# EAGLE design Blinker Board (EAGLE 6.4)
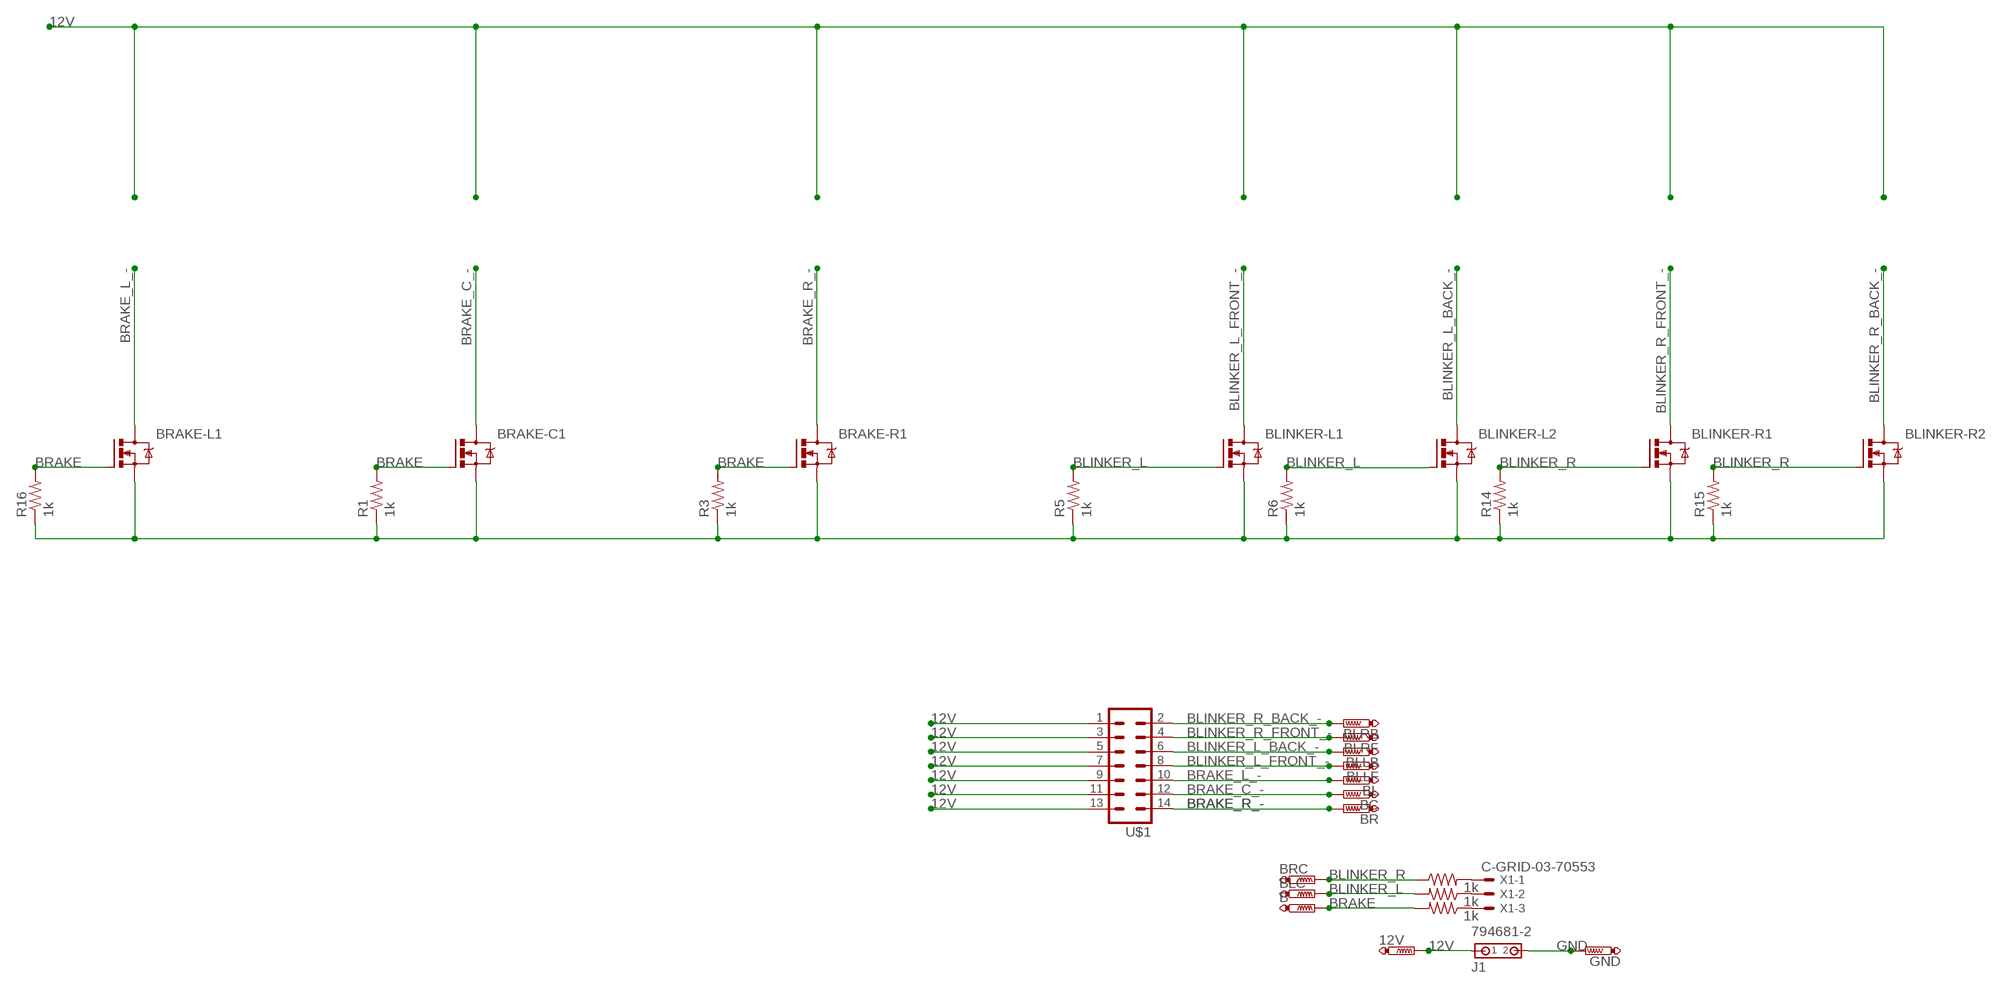
[diagram p0: schematic, sheet 1]

## Parts
12V  TESTPAD-20MIL  [20MIL]
B  TESTPAD-20MIL  [20MIL]
BC  TESTPAD-20MIL  [20MIL]
BL  TESTPAD-20MIL  [20MIL]
BLC  TESTPAD-20MIL  [20MIL]
BLINKER-L1  PMV56XN215  N-CHANNEL_MOSFETPMV56XN,215  [SOT23]
BLINKER-L2  PMV56XN215  N-CHANNEL_MOSFETPMV56XN,215  [SOT23]
BLINKER-R1  PMV56XN215  N-CHANNEL_MOSFETPMV56XN,215  [SOT23]
BLINKER-R2  PMV56XN215  N-CHANNEL_MOSFETPMV56XN,215  [SOT23]
BLLB  TESTPAD-20MIL  [20MIL]
BLLF  TESTPAD-20MIL  [20MIL]
BLRB  TESTPAD-20MIL  [20MIL]
BLRF  TESTPAD-20MIL  [20MIL]
BR  TESTPAD-20MIL  [20MIL]
BRAKE-C1  N-CHANNEL_MOSFETPMV56XN,215  [SOT23]
BRAKE-L1  PMV56XN215  N-CHANNEL_MOSFETPMV56XN,215  [SOT23]
BRAKE-R1  PMV56XN215  N-CHANNEL_MOSFETPMV56XN,215  [SOT23]
BRC  TESTPAD-20MIL  [20MIL]
GND  TESTPAD-20MIL  [20MIL]
J1  794681-2  [794681-2]
R1  1k  RESISTORSMD1206  [R1206]
R3  1k  RESISTORSMD1206  [R1206]
R5  1k  RESISTORSMD1206  [R1206]
R6  1k  RESISTORSMD1206  [R1206]
R7  1k  RESISTORSMD1206  [R1206]
R9  1k  RESISTORSMD1206  [R1206]
R10  1k  RESISTORSMD1206  [R1206]
R14  1k  RESISTORSMD1206  [R1206]
R15  1k  RESISTORSMD1206  [R1206]
R16  1k  RESISTORSMD1206  [R1206]
U$1  AMP_LATCH_14  [MA14-2]
X1  C-GRID-03-70553  [70553-03]

## Nets
12V: 12V.P$1(TP) J1.1 U$1.1 U$1.3 U$1.5 U$1.7 U$1.9 U$1.11 U$1.13
BLINKER_L: BLC.P$1(TP) BLINKER-L1.1(G) BLINKER-L2.1(G) R5.2 R6.2 R10.2
BLINKER_L_BACK_-: BLINKER-L2.3(D) BLLB.P$1(TP) U$1.6
BLINKER_L_FRONT_-: BLINKER-L1.3(D) BLLF.P$1(TP) U$1.8
BLINKER_R: BLINKER-R1.1(G) BLINKER-R2.1(G) BRC.P$1(TP) R7.1 R14.2 R15.2
BLINKER_R_BACK_-: BLINKER-R2.3(D) BLRB.P$1(TP) U$1.2
BLINKER_R_FRONT_-: BLINKER-R1.3(D) BLRF.P$1(TP) U$1.4
BRAKE: B.P$1(TP) BRAKE-C1.1(G) BRAKE-L1.1(G) BRAKE-R1.1(G) R1.2 R3.2 R9.2 R16.2
BRAKE_C_-: BC.P$1(TP) BRAKE-C1.3(D) U$1.12
BRAKE_L_-: BL.P$1(TP) BRAKE-L1.3(D) U$1.10
BRAKE_R_-: BR.P$1(TP) BRAKE-R1.3(D) U$1.14
GND: BLINKER-L1.2(S) BLINKER-L2.2(S) BLINKER-R1.2(S) BLINKER-R2.2(S) BRAKE-C1.2(S) BRAKE-L1.2(S) BRAKE-R1.2(S) GND.P$1(TP) J1.2 R1.1 R3.1 R5.1 R6.1 R14.1 R15.1 R16.1
N$1: R7.2 X1.1
N$2: R10.1 X1.2
N$3: R9.1 X1.3

## Library data of the parts
12V B BC BL BLC BLLB BLLF BLRB BLRF BR BRC GND = LTC6803:TESTPAD-20MIL
BLINKER-L1 BLINKER-L2 BLINKER-R1 BLINKER-R2 BRAKE-C1 BRAKE-L1 BRAKE-R1 = SolarJacketsADC:N-CHANNEL_MOSFET; PART_NUM: PMV56XN,215
J1 = con-amp:794681-2: Micro MATE-N-LOK Connectors grid 1.5mm Dual Row Through Hole Vertical Metal Through Hole Holddowns Source: ENG_CD_794681_E.pdf
R1 R3 R5-R7 R9 R10 R14-R16 = SolarJacketsADC:RESISTOR; PART_NUM: CR1206-FX-1001GLF
U$1 = SolarJackets_Common:AMP_LATCH_14
X1 = con-molex:C-GRID-03: CONNECTOR wire to board 2.54 mm (0.100") pitch header; OC_FARNELL: unknown; OC_NEWARK: unknown

## Board
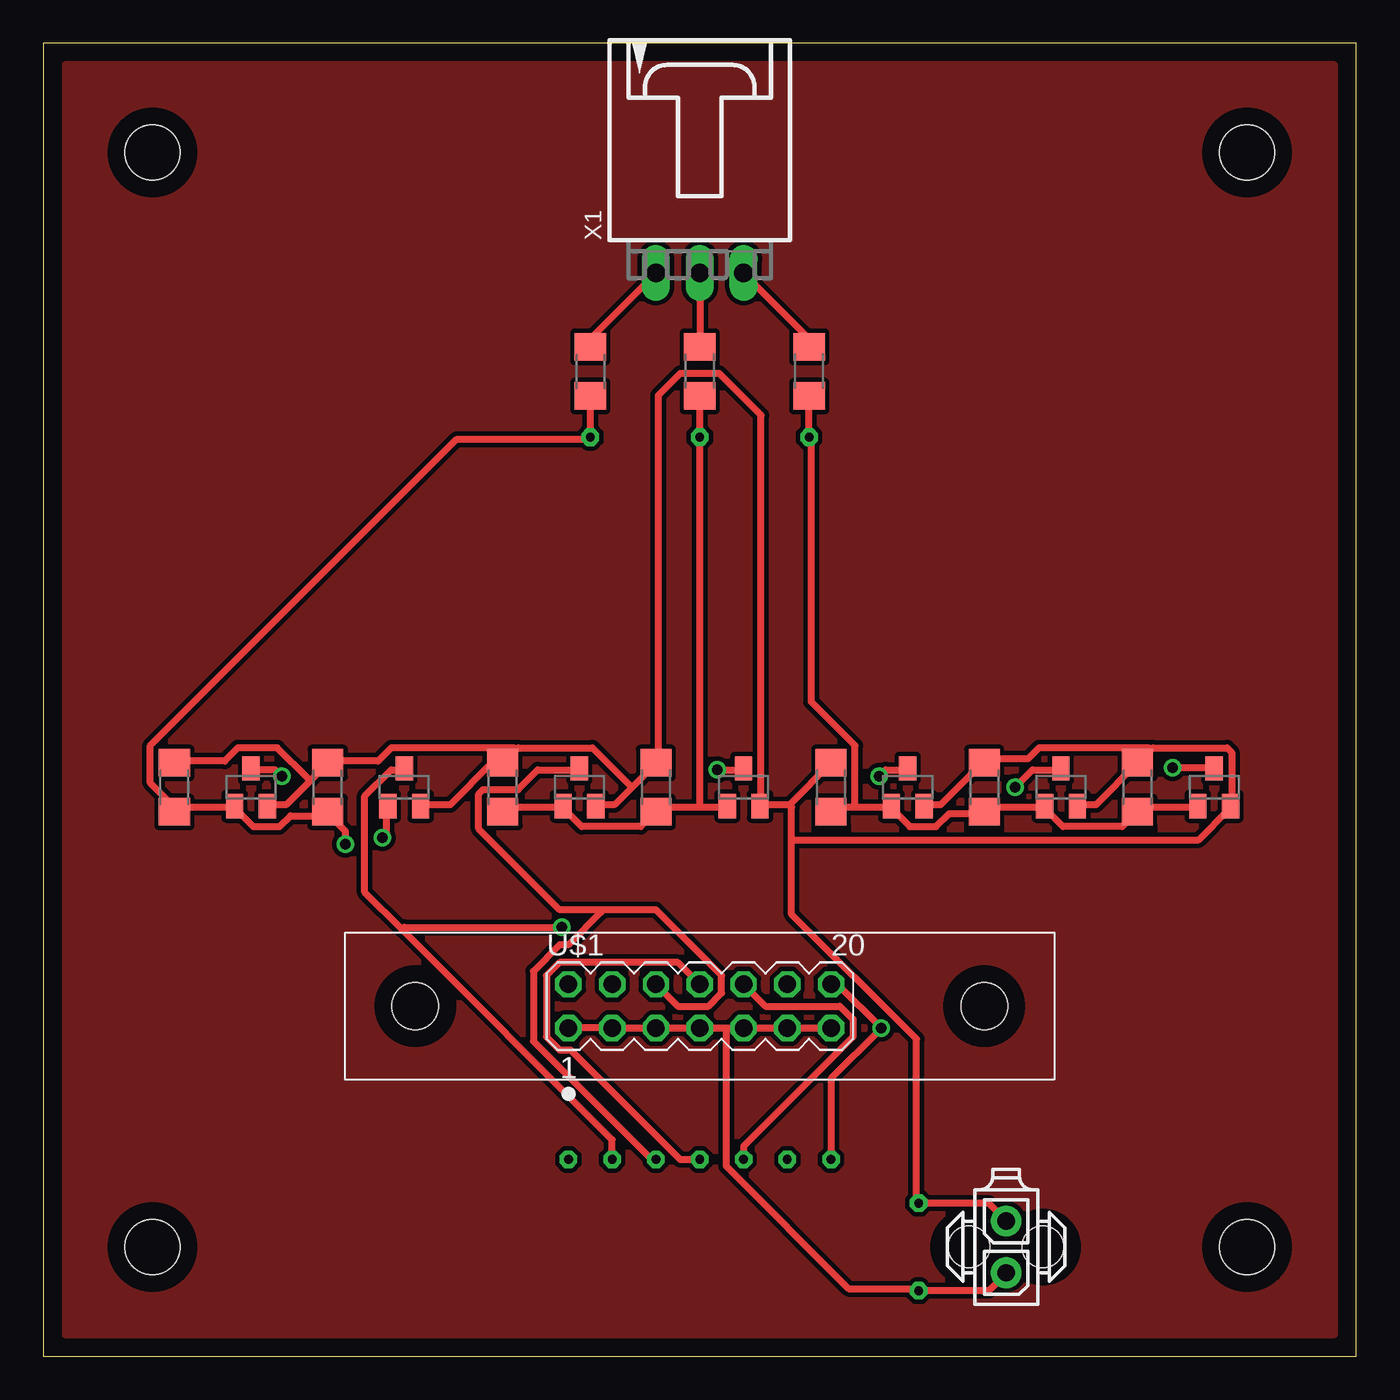
[diagram p1: board, top side]
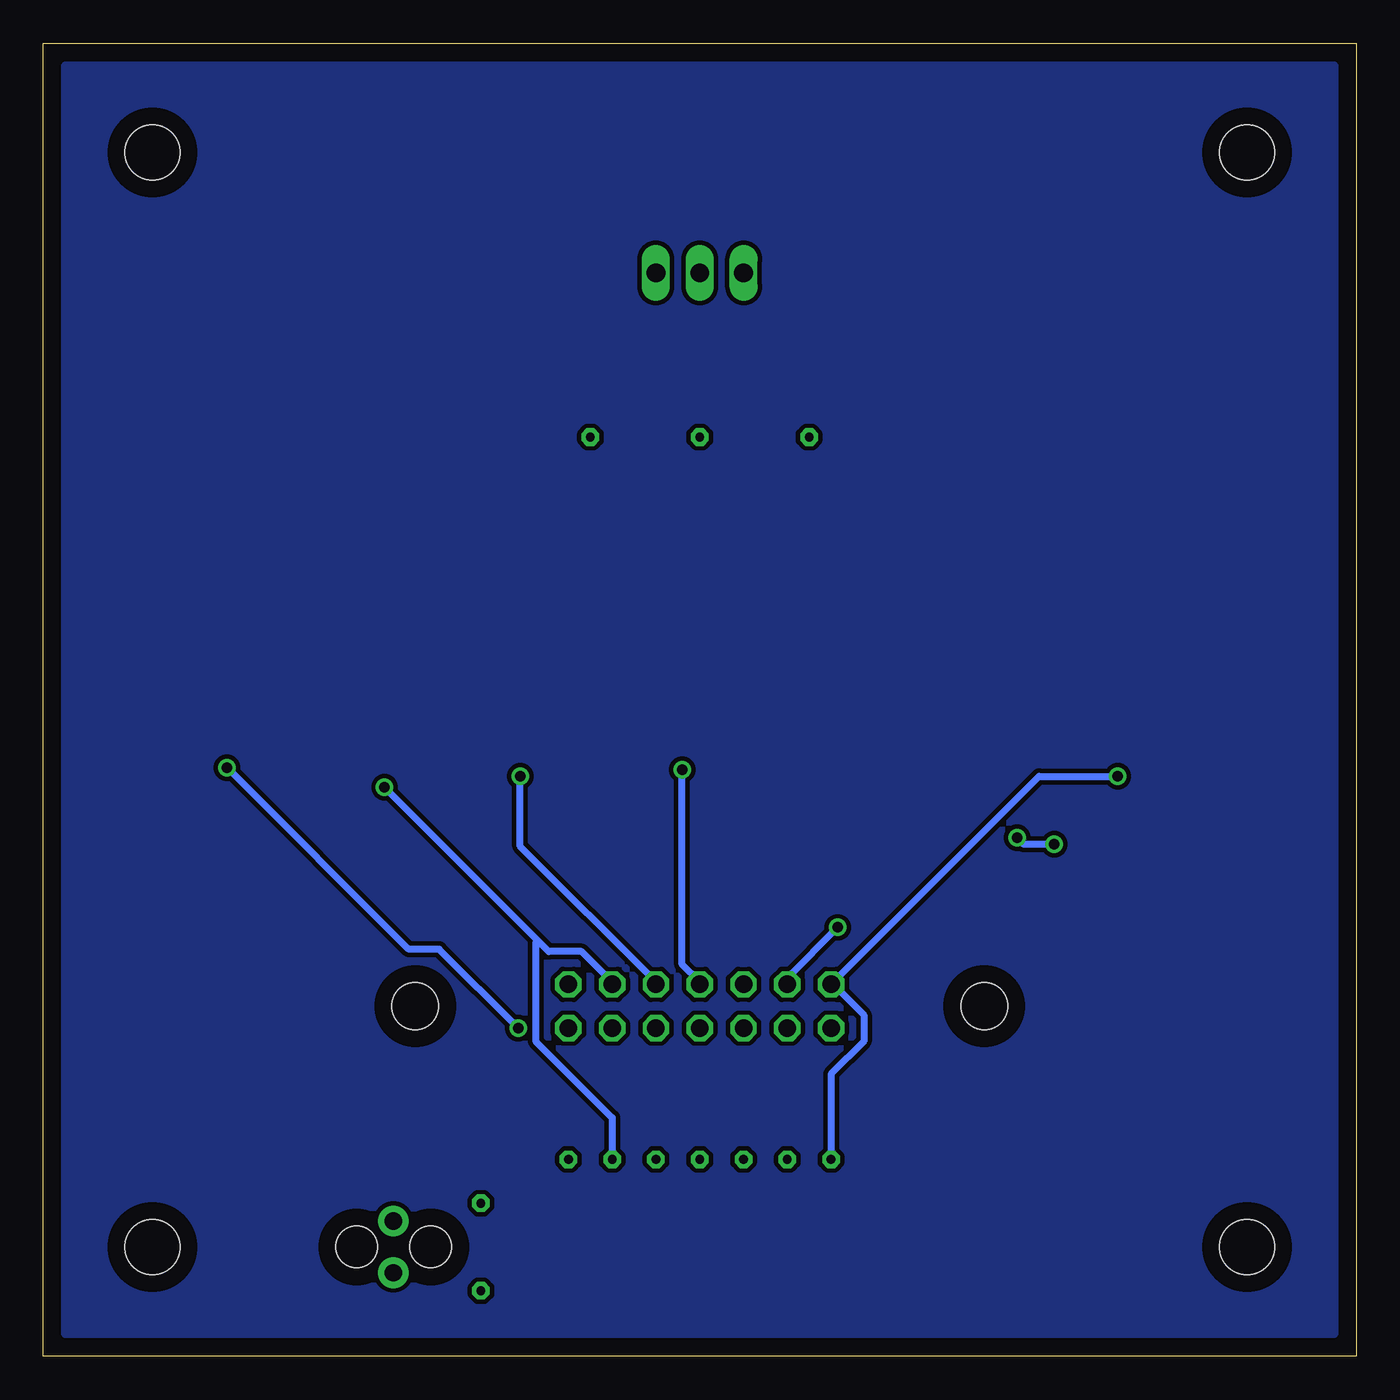
[diagram p2: board, bottom side, seen from below]

Size 76.2 x 76.2 mm. Coordinates in mm from the lower left corner, seen from the top.
Outline: 0,0 76.2,0 76.2,76.2 0,76.2 0,0
Copper layers (1*16): Top 0.035mm / dielectric 1.5mm / Bottom 0.035mm
Design rules "SJ Design Rules *": minimum track width 16mil, minimum drill 20mil, track to track 10mil, track to pad 10mil, pad to pad 10mil, via to via 10mil, smd to smd 10mil, copper to edge 40mil, drill to drill 10mil, minimum pad ring 10mil, minimum via ring 8mil, stop-mask expansion 4mil, vias tented up to drill 0mil, thermal gap 20mil
Holes 3.17 mm at 6.35,6.35 69.85,6.35 6.35,69.85 69.85,69.85

### Footprints (pad centres in the part's own frame; a part is rotated, then mirrored left to right if it is on the bottom)
20MIL = drill 0.508 octagon: P$1 0,0
SOT23 = smd 1 x 1.4: 1 -0.95,-1.1; 2 0.95,-1.1; 3 0,1.1
794681-2 = drill 1 pad 1.778: 1 0,-1.5; 2 0,1.5 | hole 2.4: 2.13,0; -2.17,0
R1206 = smd 1.6 x 1.803: 1 -1.422,0; 2 1.422,0
MA14-2 = drill 1.016 octagon: 1 -11.43,-1.27; 2 -11.43,1.27; 3 -8.89,-1.27; 4 -8.89,1.27; 5 -6.35,-1.27; 6 -6.35,1.27; 7 -3.81,-1.27; 8 -3.81,1.27; 9 -1.27,-1.27; 10 -1.27,1.27; 11 1.27,-1.27; 12 1.27,1.27; 13 3.81,-1.27; 14 3.81,1.27 | hole 2.692: -20.32,0; 12.7,0
70553-03 = drill 1.092 long: 1 -2.54,-7.62; 2 0,-7.62; 3 2.54,-7.62

### Placement (x,y rotation side)
12V  50.8,3.81 0 top
B  44.45,53.34 0 top
BC  43.18,11.43 0 top
BL  40.64,11.43 0 top
BLC  38.1,53.34 0 top
BLINKER-L1  40.64,33.02 0 top
BLINKER-L2  31.11,33.02 0 top
BLINKER-R1  20.95,33.02 0 top
BLINKER-R2  12.06,33.02 0 top
BLLB  35.56,11.43 0 top
BLLF  38.1,11.43 0 top
BLRB  30.48,11.43 0 top
BLRF  33.02,11.43 0 top
BR  45.72,11.43 0 top
BRAKE-C1  59.05,33.02 0 top
BRAKE-L1  50.16,33.02 0 top
BRAKE-R1  67.94,33.02 0 top
BRC  31.75,53.34 0 top
GND  50.8,8.89 0 top
J1  55.88,6.35 0 top
R1  54.61,33.02 270 top
R3  63.5,33.02 270 top
R5  35.56,33.02 270 top
R6  26.67,33.02 270 top
R7  31.75,57.15 90 top
R9  44.45,57.15 270 top
R10  38.1,57.15 270 top
R14  16.51,33.02 270 top
R15  7.62,33.02 270 top
R16  45.72,33.02 270 top
U$1  41.91,20.32 0 top
X1  38.1,70.48 0 top

### Tracks (layer width: path | path; a pad name or v marks a point on that pad's centre or on a via)
12V
  Top 0.406: J1.1 55.88,4.83 54.86,3.81 12V.P$1 50.67,3.94 46.74,3.94 39.62,11.05 39.62,18.92 39.62,19.05 | U$1.1 U$1.3 33.15,19.05 U$1.5 35.69,19.05 U$1.7 38.23,19.05 39.62,19.05 | 39.62,19.05 U$1.9 40.77,19.05 U$1.11 43.31,19.05 U$1.13
BLINKER_L
  Top 0.406: R6.2 26.67,31.62 26.92,31.88 30.1,31.88 BLINKER-L2.1 30.23,31.75 31.24,30.73 34.67,30.73 35.43,31.5 R5.2 35.56,31.62 35.81,31.88 38.1,31.88 | R10.2 38.1,55.63 BLC.P$1 38.1,53.21 38.1,32 38.1,31.88 | 38.1,31.88 39.62,31.88 BLINKER-L1.1
BLINKER_L_BACK_-
  Top 0.406: 32.38,25.91 35.56,25.91 39.37,22.1 39.37,21.08 38.61,20.32 36.83,20.32 U$1.6 | 32.38,25.91 29.97,25.91 25.27,30.61 25.27,32.64 25.53,32.89 27.56,32.89 28.7,34.04 31.11,34.04 BLINKER-L2.3 | BLLB.P$1 35.31,11.43 28.45,18.29 28.45,22.35 29.97,23.88 30.48,23.88 32.38,25.78 32.38,25.91
BLINKER_L_FRONT_-  (via drill 0.61)
  Top 0.406: v39.12,34.04 40.64,34.04 BLINKER-L1.3 | BLLF.P$1 36.96,11.43 30.61,17.78 29.97,17.78 29.21,18.54 29.21,22.1 29.97,22.86 36.83,22.86 U$1.8
  Bottom 0.406: v39.12,34.04 39.12,22.73 38.1,21.72 U$1.8
BLINKER_R  (via drill 0.61)
  Top 0.406: v19.68,30.1 19.94,30.35 19.94,31.88 BLINKER-R1.1 | v17.53,29.72 17.53,30.48 16.51,31.5 R14.2 16.38,31.37 14.35,31.37 13.72,30.73 12.19,30.73 11.18,31.75 BLINKER-R2.1 11.05,31.88 7.87,31.88 7.62,31.62 R15.2 7.62,31.88 6.22,33.27 6.22,35.43 24,53.21 31.62,53.21 BRC.P$1 31.75,55.63 R7.1
  Bottom 0.406: v19.68,30.1 19.3,29.72 v17.53,29.72
BLINKER_R_BACK_-  (via drill 0.61)
  Top 0.406: v13.84,33.66 13.46,34.04 12.06,34.04 BLINKER-R2.3
  Bottom 0.406: v13.84,33.66 18.41,33.66 U$1.2 30.35,21.59 28.57,19.81 28.57,18.29 30.48,16.38 BLRB.P$1
BLINKER_R_FRONT_-  (via drill 0.61)
  Top 0.406: 20.83,24.77 33.02,12.57 BLRF.P$1 | 20.83,24.77 18.67,26.92 18.67,32.51 20.19,34.04 20.95,34.04 BLINKER-R1.3 | v30.1,24.89 20.95,24.89 20.83,24.77
  Bottom 0.406: U$1.4 33.02,21.97 v30.1,24.89
BRAKE
  Top 0.406: BRAKE-R1.1 66.93,31.88 63.75,31.88 63.5,31.62 R3.2 63.37,31.5 62.61,30.73 59.18,30.73 58.17,31.75 BRAKE-C1.1 58.04,31.88 54.86,31.88 54.61,31.62 R1.2 54.48,31.5 52.58,31.5 51.82,30.73 50.29,30.73 49.28,31.75 BRAKE-L1.1 49.15,31.88 47.12,31.88 | R9.2 44.45,55.63 B.P$1 44.58,53.21 44.58,37.97 47.12,35.43 47.12,32 47.12,31.88 | 47.12,31.88 45.97,31.88 45.72,31.62 R16.2
BRAKE_C_-  (via drill 0.61)
  Top 0.406: v56.39,33.02 57.4,34.04 59.05,34.04 BRAKE-C1.3
  Bottom 0.406: 47.5,24.13 46.86,23.5 44.96,23.5 43.18,21.72 U$1.12 | 47.5,24.13 v56.39,33.02 | BC.P$1 43.18,13.84 47.62,18.29 47.62,24 47.5,24.13
BRAKE_L_-  (via drill 0.61)
  Top 0.406: v48.51,33.66 48.9,34.04 50.16,34.04 BRAKE-L1.3 | BL.P$1 40.64,12.19 46.99,18.54 46.99,19.56 46.23,20.32 41.91,20.32 U$1.10
  Bottom 0.406: v48.51,33.66 48.51,29.59 40.64,21.72 U$1.10
BRAKE_R_-  (via drill 0.61)
  Top 0.406: v65.53,34.16 67.94,34.16 BRAKE-R1.3 | U$1.14 46.1,21.59 v48.64,19.05 48.51,18.92 45.72,16.13 BR.P$1
  Bottom 0.406: v65.53,34.16 54.99,23.62 53.21,23.62 v48.64,19.05
GND
  Top 0.406: 15.49,33.4 16.51,34.42 R14.1 16.64,34.54 19.43,34.54 20.19,35.31 27.3,35.31 27.43,35.18 | 15.49,33.4 14.1,32 13.08,32 BLINKER-R2.2 | R15.1 7.62,34.54 10.54,34.54 11.3,35.31 13.59,35.31 15.37,33.53 15.49,33.4 | 34.16,33.02 35.56,34.42 R5.1 35.69,34.54 35.69,55.75 36.96,57.02 39.24,57.02 41.66,54.61 41.66,32.13 BLINKER-L1.2 41.66,32 43.31,32 | 34.16,33.02 33.15,32 32.13,32 BLINKER-L2.2 | BLINKER-R1.2 21.97,32 23.62,32 26.04,34.42 26.67,34.42 R6.1 26.8,34.54 27.43,35.18 | 27.43,35.18 27.56,35.31 31.88,35.31 34.04,33.15 34.16,33.02 | BRAKE-L1.2 51.18,32 52.07,32 54.61,34.54 R1.1 54.74,34.67 57.15,34.67 57.78,35.31 64.14,35.31 64.26,35.18 | BRAKE-C1.2 60.07,32 61.09,32 63.5,34.42 R3.1 63.63,34.54 64.26,35.18 | 64.26,35.18 64.39,35.31 68.71,35.31 68.96,35.05 68.96,32 BRAKE-R1.2 68.83,31.75 67.06,29.97 43.56,29.97 43.43,29.97 | 43.31,32 45.72,34.42 R16.1 | J1.2 55.88,7.87 54.86,8.89 GND.P$1 50.67,9.02 50.67,18.41 43.43,25.65 43.43,29.97 | 43.43,29.97 43.43,31.88 43.31,32
N$1
  Top 0.406: X1.1 31.75,59.05 31.75,58.67 R7.2
N$2
  Top 0.406: X1.2 38.1,58.67 R10.1
N$3
  Top 0.406: X1.3 44.45,59.05 44.45,58.67 R9.1
N$4
  pour Top: 1.27,74.93 1.27,1.27 74.93,1.27 74.93,74.93
  pour Bottom: 1.27,74.93 1.27,1.27 74.93,1.27 74.93,74.93

### Text on the board
tValues: Blinker Left | Blinker Right | Brake | Blinker Board | 12V | Blinker Right Back / / Blinker Right Front / / Blinker Left Back / / Blinker Left Front / / Brake Left / / Brake Center / / Brake Right | GND
bValues: REV 2 4/22/2013